# Altium schematic sheet Copy of DAC_PWW_Outputs.SchDoc: DAC/PWM Outputs
size A; DrawnBy: Andrew Pobrica; DocumentNumber: 6; SheetNumber: 6; SheetTotal: 7
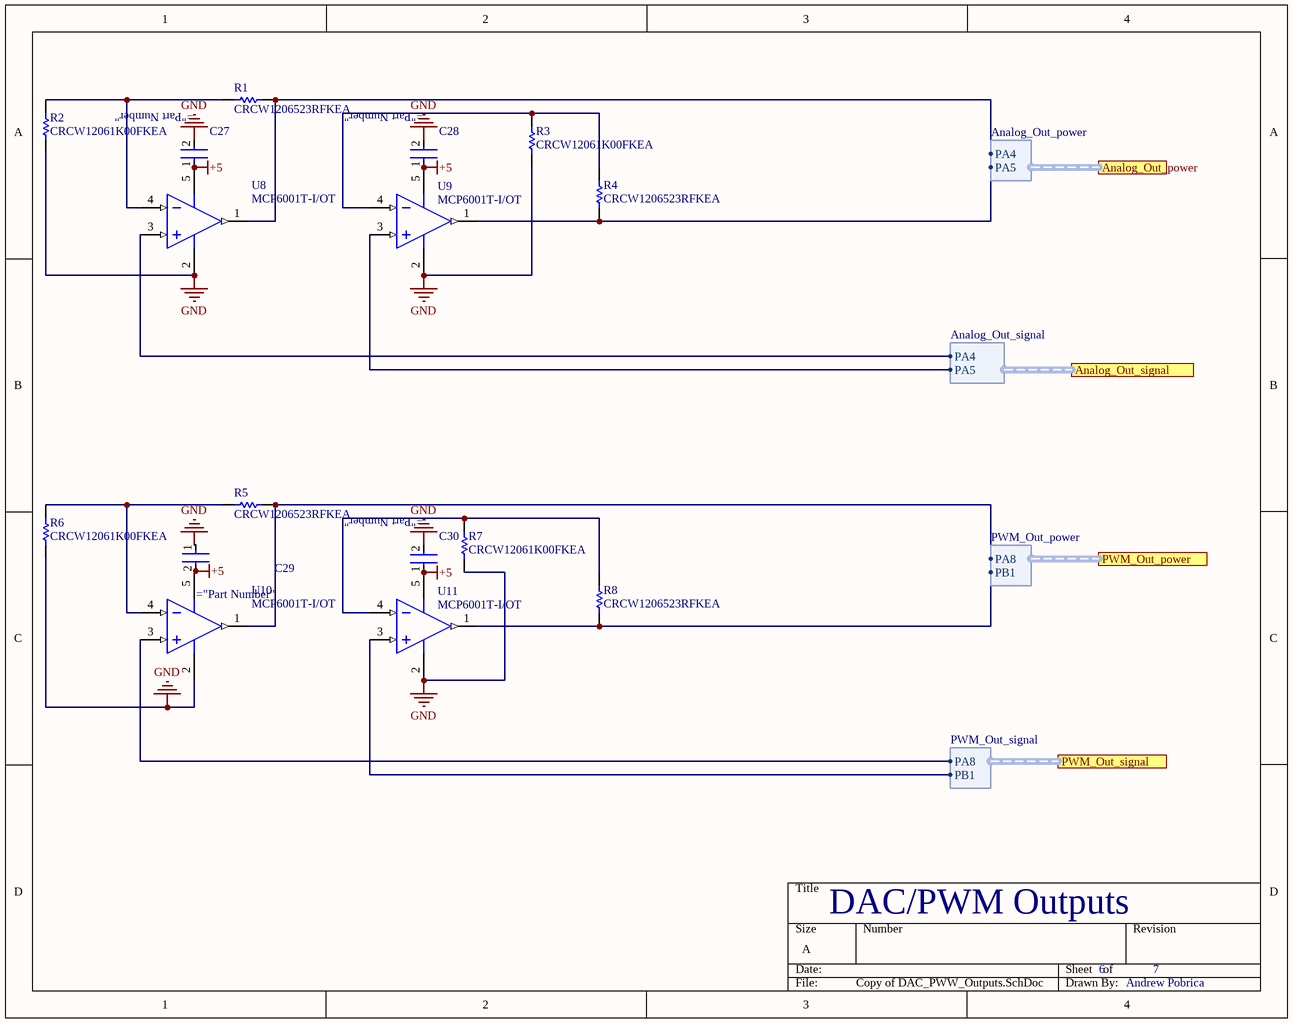
[diagram p0: Copy of DAC_PWW_Outputs.SchDoc]

## Parts
C27  C0603C104K5RACTU  [Kemet_C0805_IPC_A]  (value not drawn)
C28  C0603C104K5RACTU  [Kemet_C0805_IPC_A]  (value not drawn)
C29  C0603C104K5RACTU  [Kemet_C0805_IPC_A]  (value not drawn)
C30  C0603C104K5RACTU  [Kemet_C0805_IPC_A]  (value not drawn)
R1  CRCW1206523RFKEA  [RESC3216X60X45NL10T20]
R2  CRCW12061K00FKEA  [RESC3216X60X45ML15T20]
R3  CRCW12061K00FKEA  [RESC3216X60X45ML15T20]
R4  CRCW1206523RFKEA  [RESC3216X60X45NL10T20]
R5  CRCW1206523RFKEA  [RESC3216X60X45NL10T20]
R6  CRCW12061K00FKEA  [RESC3216X60X45ML15T20]
R7  CRCW12061K00FKEA  [RESC3216X60X45ML15T20]
R8  CRCW1206523RFKEA  [RESC3216X60X45NL10T20]
U8  MCP6001T-I/OT  [SOT-23-OT5_CUSTOM]
U9  MCP6001T-I/OT  [SOT-23-OT5_CUSTOM]
U10  MCP6001T-I/OT  [SOT-23-OT5_CUSTOM]
U11  MCP6001T-I/OT  [SOT-23-OT5_CUSTOM]

## Ports
Analog_Out_power (harness Analog_Out_power), Analog_Out_signal (harness Analog_Out_signal), PWM_Out_power (harness PWM_Out_power), PWM_Out_signal (harness PWM_Out_signal)

## Harnesses
Analog_Out_power: PA4, PA5
PWM_Out_power: PA8, PB1
PWM_Out_signal: PA8, PB1
Analog_Out_signal: PA4, PA5

## Nets
+5: C27.1 C28.1 C29.2 C30.1 U8.5(VDD) U9.5(VDD) U10.5(VDD) U11.5(VDD)
GND: C27.2 C28.2 C29.1 C30.2 R2.2 R3.2 R6.2 R7.2 U8.2(VSS) U9.2(VSS) U10.2(VSS) U11.2(VSS)
NetR1_1: R1.1 U8.1(VOUT) ; port Analog_Out_power.PA4
NetR1_2: R1.2 R2.1 U8.4(VIN-)
NetR3_1: R3.1 R4.2 U9.4(VIN-)
NetR4_1: R4.1 U9.1(VOUT) ; port Analog_Out_power.PA5
NetR5_1: R5.1 U10.1(VOUT) ; port PWM_Out_power.PA8
NetR5_2: R5.2 R6.1 U10.4(VIN-)
NetR7_1: R7.1 R8.2 U11.4(VIN-)
NetR8_1: R8.1 U11.1(VOUT) ; port PWM_Out_power.PB1
NetU8_3: U8.3(VIN+) ; port Analog_Out_signal.PA4
NetU9_3: U9.3(VIN+) ; port Analog_Out_signal.PA5
NetU10_3: U10.3(VIN+) ; port PWM_Out_signal.PA8
NetU11_3: U11.3(VIN+) ; port PWM_Out_signal.PB1

## Library data of the parts
R1 R4 R5 R8 = CMP-2003-02266-1: Manufacturer: Vishay Dale; Part Number: CRCW1206523RFKEA
R2 R3 R6 R7 = CMP-2100-03616-1: Chip Resistor, 1 KOhm, +/- 1%, 0.25 W, -55 to 155 degC, 1206 (3216 Metric), RoHS, Tape and Reel; Manufacturer: Vishay Semiconductor; Power Rating: 250mW; Voltage Rating (DC): 200V; Resistance: 1KOhm; Temperature Coefficient: 100ppm/degreesC; Case Code (Imperial): 1206; Length: 3.2mm; Case/Package: 1206; Contact Plating: Tin; Package Quantity: 10; Datasheet URL: http://www.farnell.com/datasheets/1720486.pdf; Mount: SurfaceMount; Package Description: 2-Pin Surface Mount Device, Body 3.15 x 1.6 mm; Package Reference: 1206.0; Max Operating Temperature: 155degC; Lead Free: LeadFree; Weight: 0.000353oz; Military Standard: Not; Max Power Dissipation: 250mW; Case Code (Metric): 3216; Number of Terminations: 2; Tolerance: 1%; Width: 0.063inch; Termination: SMD/SMT; Number of Pins: 2; Min Operating Temperature: -55degC; Height: 0.55mm; Depth: 1.6mm; RoHSCompliant: true; Composition: ThickFilm; Packaging: TapeandReel; Manufacturer URL: http://www.vishay.com/; Voltage Rating: 200V; Radiation Hardening: No; REACH SVHC: Unknown; Datasheet Version: 41061.0
U8 U11 = CMP-0187-00462-2: 1 MHz, Low-Power Operational Amplifier, 5-Pin SOT-23, Industrial Temperature, Tape and Reel; RevisionNote: URLs added.; PackageReference: SOT-23-OT5; ComponentLink1URL: http://www.microchip.com/; DatasheetVersion: revJ, Nov-2009; ComponentLink3URL: http://www.microchip.com/stellent/groups/techpub_sg/documents/packagingspec/en012702.pdf; PackageVersion: revBB, Aug-2009; ComponentLink2Description: Datasheet; ComponentLink3Description: Package Specification; PackageDescription: 5-Lead Plastic Small Outline Transistor (OT) [SOT-23]; ComponentLink2URL: http://ww1.microchip.com/downloads/en/DeviceDoc/21733j.pdf; ComponentLink1Description: Manufacturer URL; Code_IPC: SOT23-5
U9 U10 = AMP-OPA-MCP6001-SOT5: 1 MHz, Low-Power Operational Amplifier, 5-Pin SOT-23, Industrial Temperature, Tape and Reel; RevisionNote: URLs added.; PackageReference: SOT-23-OT5; ComponentLink1URL: http://www.microchip.com/; DatasheetVersion: revJ, Nov-2009; ComponentLink3URL: http://www.microchip.com/stellent/groups/techpub_sg/documents/packagingspec/en012702.pdf; PackageVersion: revBB, Aug-2009; ComponentLink2Description: Datasheet; ComponentLink3Description: Package Specification; PackageDescription: 5-Lead Plastic Small Outline Transistor (OT) [SOT-23]; ComponentLink2URL: http://ww1.microchip.com/downloads/en/DeviceDoc/21733j.pdf; ComponentLink1Description: Manufacturer URL; Code_IPC: SOT23-5